# Altium schematic sheet DIGITAL_IO.SchDoc: Digital IO
size B; Engineer: M. Jones; Organization: Michael Jones; DocumentNumber: 4; Revision: RA.1; SheetNumber: 4; SheetTotal: 7
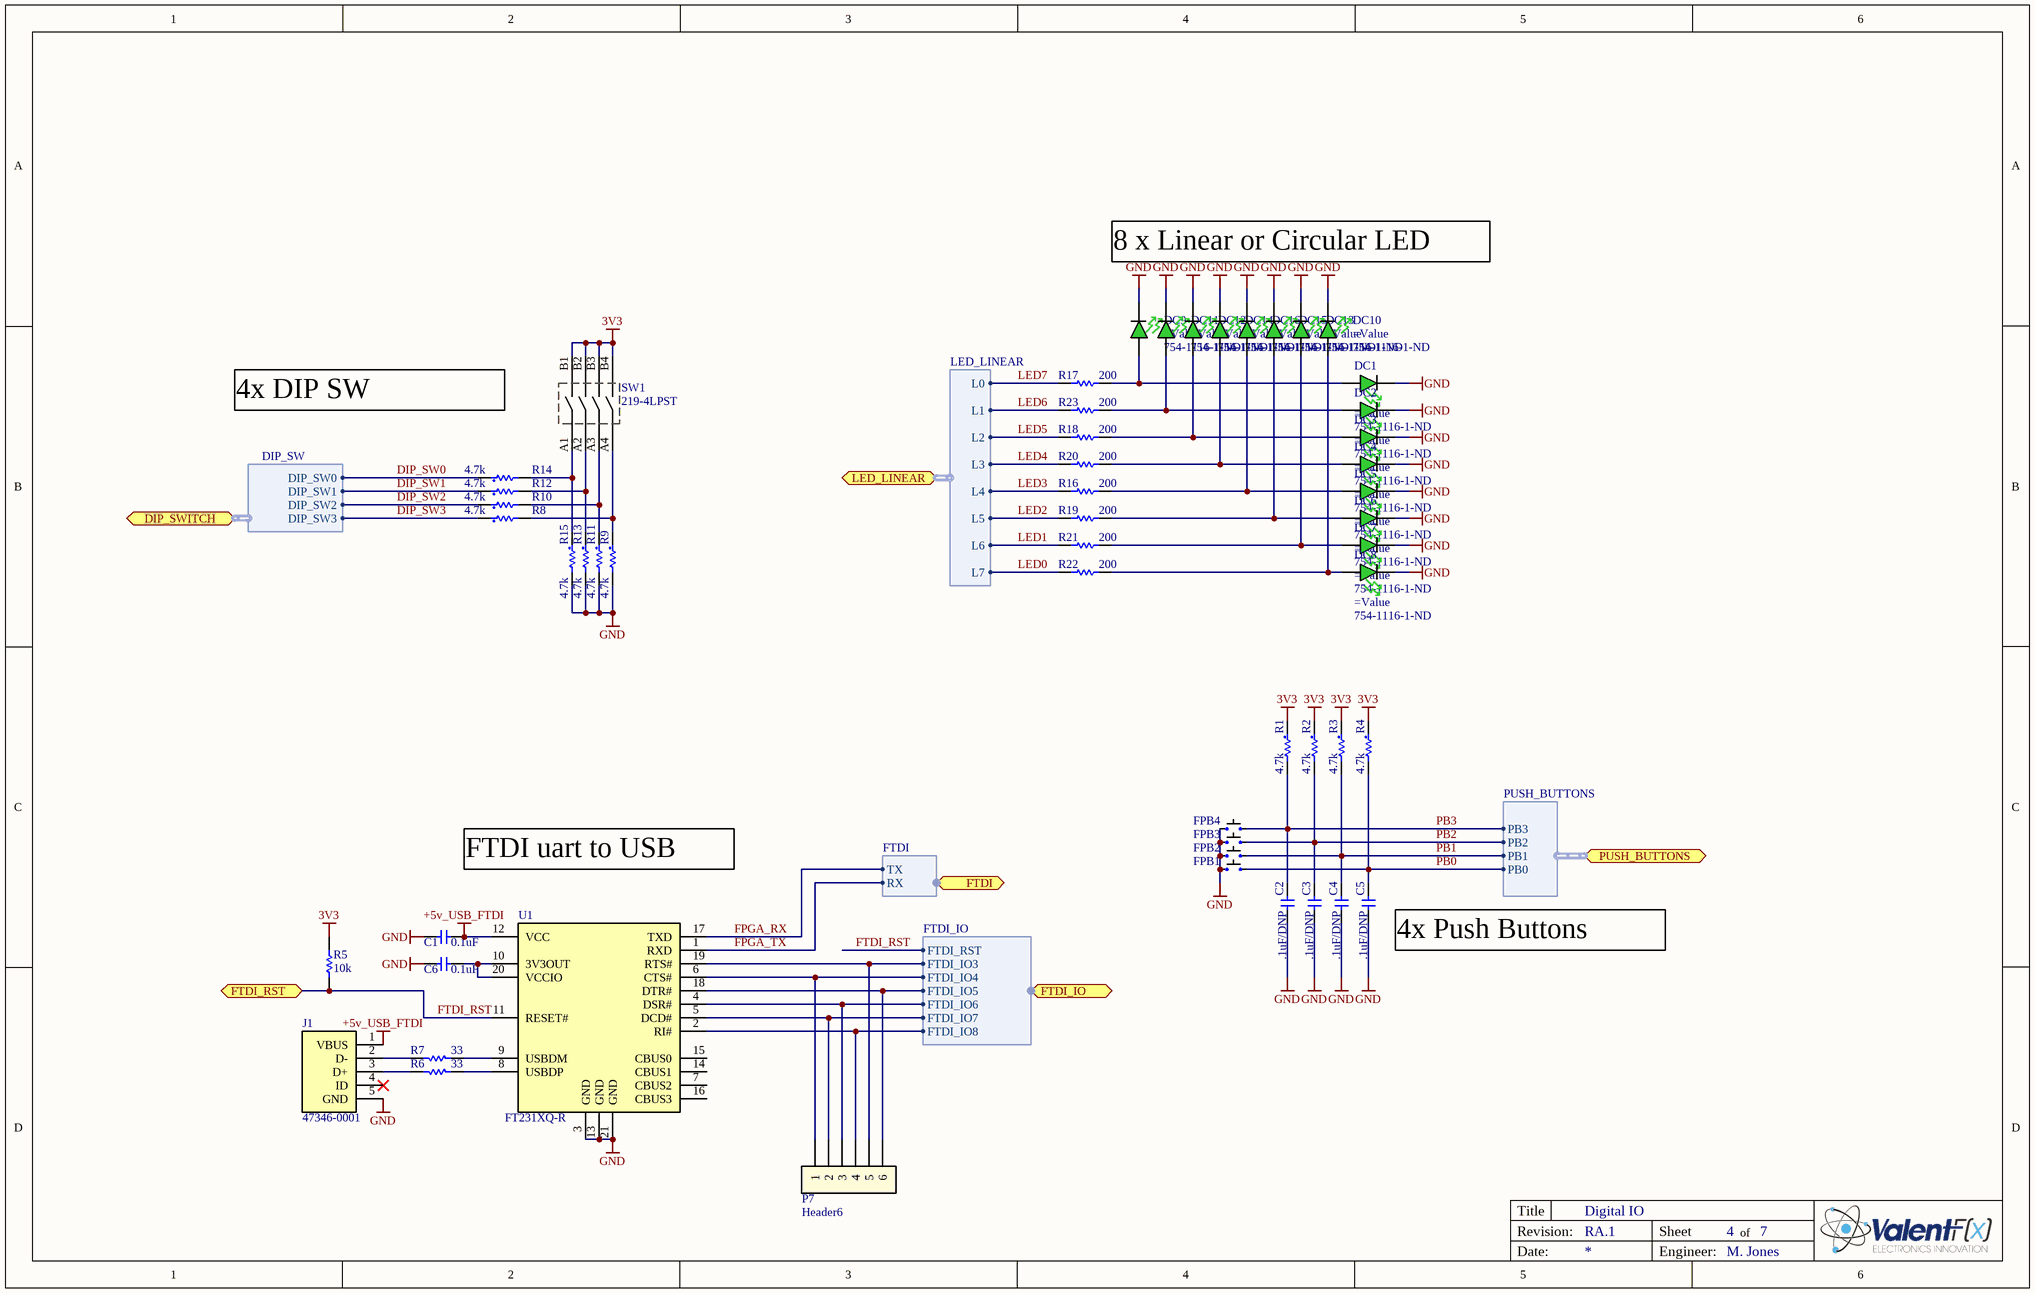
[diagram p0: DIGITAL_IO.SchDoc]

## Parts
C1  0.1uF  [C0603]
C2  .1uF/DNP  [C0603]
C3  .1uF/DNP  [C0603]
C4  .1uF/DNP  [C0603]
C5  .1uF/DNP  [C0603]
C6  0.1uF  [C0603]
DC1  Supplier Part Number 1: 754-1116-1-ND  [LED_0603 - GREEN]
DC2  Supplier Part Number 1: 754-1116-1-ND  [LED_0603 - GREEN]
DC3  Supplier Part Number 1: 754-1116-1-ND  [LED_0603 - GREEN]
DC4  Supplier Part Number 1: 754-1116-1-ND  [LED_0603 - GREEN]
DC5  Supplier Part Number 1: 754-1116-1-ND  [LED_0603 - GREEN]
DC6  Supplier Part Number 1: 754-1116-1-ND  [LED_0603 - GREEN]
DC7  Supplier Part Number 1: 754-1116-1-ND  [LED_0603 - GREEN]
DC8  Supplier Part Number 1: 754-1116-1-ND  [LED_0603 - GREEN]
DC9  Supplier Part Number 1: 754-1116-1-ND  [LED_0603 - GREEN]
DC10  Supplier Part Number 1: 754-1116-1-ND  [LED_0603 - GREEN]
DC11  Supplier Part Number 1: 754-1116-1-ND  [LED_0603 - GREEN]
DC12  Supplier Part Number 1: 754-1116-1-ND  [LED_0603 - GREEN]
DC13  Supplier Part Number 1: 754-1116-1-ND  [LED_0603 - GREEN]
DC14  Supplier Part Number 1: 754-1116-1-ND  [LED_0603 - GREEN]
DC15  Supplier Part Number 1: 754-1116-1-ND  [LED_0603 - GREEN]
DC16  Supplier Part Number 1: 754-1116-1-ND  [LED_0603 - GREEN]
FPB1  (no value)  [FSM4JSMA]
FPB2  (no value)  [FSM4JSMA]
FPB3  (no value)  [FSM4JSMA]
FPB4  (no value)  [FSM4JSMA]
J1  47346-0001  [USB - 47346-0001]
P7  Header6  [HEADER_6_30_100 SMT SIP]
R1  4.7k  [R0603]
R2  4.7k  [R0603]
R3  4.7k  [R0603]
R4  4.7k  [R0603]
R5  10k  [R0603]
R6  33  [R0603]
R7  33  [R0603]
R8  4.7k  [R0603]
R9  4.7k  [R0603]
R10  4.7k  [R0603]
R11  4.7k  [R0603]
R12  4.7k  [R0603]
R13  4.7k  [R0603]
R14  4.7k  [R0603]
R15  4.7k  [R0603]
R16  200  [R0603]
R17  200  [R0603]
R18  200  [R0603]
R19  200  [R0603]
R20  200  [R0603]
R21  200  [R0603]
R22  200  [R0603]
R23  200  [R0603]
SW1  219-4LPST  [ADE04S04]
U1  FT231XQ-R  [QFN-20_L]

## Ports
DIP_SWITCH (harness DIP_SW), FTDI (harness FTDI), FTDI_IO (harness FTDI_IO), FTDI_RST, LED_LINEAR (harness LED_LINEAR), PUSH_BUTTONS (harness PUSH_BUTTONS)

## Harnesses
PUSH_BUTTONS: PB0, PB1, PB2, PB3
LED_LINEAR: L0, L1, L2, L3, L4, L5, L6, L7
FTDI: TX, RX
FTDI_IO: FTDI_IO3, FTDI_IO4, FTDI_IO5, FTDI_IO6, FTDI_IO7, FTDI_IO8, FTDI_RST
DIP_SW: DIP_SW0, DIP_SW1, DIP_SW2, DIP_SW3

## Nets
3V3: R1.1 R2.1 R3.1 R4.1 R5.1 SW1.B1 SW1.B2 SW1.B3 SW1.B4
+5v_USB_FTDI: C1.2 J1.1(VBUS) U1.12(VCC)
GND: C1.1 C2.2 C3.2 C4.2 C5.2 C6.1 DC1.C DC2.C DC3.C DC4.C DC5.C DC6.C DC7.C DC8.C DC9.C DC10.C DC11.C DC12.C DC13.C DC14.C DC15.C DC16.C FPB1.A FPB2.A FPB3.A FPB4.A J1.5(GND) R9.2 R11.2 R13.2 R15.2 U1.3(GND) U1.13(GND) U1.21(GND)
DIP_SW0: R14.1 ; port DIP_SWITCH.DIP_SW0
DIP_SW1: R12.1 ; port DIP_SWITCH.DIP_SW1
DIP_SW2: R10.1 ; port DIP_SWITCH.DIP_SW2
DIP_SW3: R8.1 ; port DIP_SWITCH.DIP_SW3
FPGA_RX: U1.17(TXD) ; port FTDI.TX
FPGA_TX: U1.1(RXD) ; port FTDI.RX
FTDI_RST: R5.2 U1.11(RESET#) ; port FTDI_RST, port FTDI_IO.FTDI_RST
LED0: R22.2 ; port LED_LINEAR.L7
LED1: R21.2 ; port LED_LINEAR.L6
LED2: R19.2 ; port LED_LINEAR.L5
LED3: R16.2 ; port LED_LINEAR.L4
LED4: R20.2 ; port LED_LINEAR.L3
LED5: R18.2 ; port LED_LINEAR.L2
LED6: R23.2 ; port LED_LINEAR.L1
LED7: R17.2 ; port LED_LINEAR.L0
PB0: C5.1 FPB1.B R4.2 ; port PUSH_BUTTONS.PB0
PB1: C4.1 FPB2.B R3.2 ; port PUSH_BUTTONS.PB1
PB2: C3.1 FPB3.B R2.2 ; port PUSH_BUTTONS.PB2
PB3: C2.1 FPB4.B R1.2 ; port PUSH_BUTTONS.PB3
NetC6_2: C6.2 U1.10(3V3OUT) U1.20(VCCIO)
NetDC1_A: DC1.A DC9.A R17.1
NetDC2_A: DC2.A DC11.A R23.1
NetDC3_A: DC3.A DC12.A R18.1
NetDC4_A: DC4.A DC14.A R20.1
NetDC5_A: DC5.A DC16.A R16.1
NetDC6_A: DC6.A DC15.A R19.1
NetDC7_A: DC7.A DC13.A R21.1
NetDC8_A: DC8.A DC10.A R22.1
NetJ1_2: J1.2(D-) R7.2
NetJ1_3: J1.3(D+) R6.2
NetP7_1: P7.1 U1.6(CTS#) ; port FTDI_IO.FTDI_IO4
NetP7_2: P7.2 U1.5(DCD#) ; port FTDI_IO.FTDI_IO7
NetP7_3: P7.3 U1.4(DSR#) ; port FTDI_IO.FTDI_IO6
NetP7_4: P7.4 U1.2(RI#) ; port FTDI_IO.FTDI_IO8
NetP7_5: P7.5 U1.19(RTS#) ; port FTDI_IO.FTDI_IO3
NetP7_6: P7.6 U1.18(DTR#) ; port FTDI_IO.FTDI_IO5
NetR6_1: R6.1 U1.8(USBDP)
NetR7_1: R7.1 U1.9(USBDM)
NetR8_2: R8.2 R9.1 SW1.A4
NetR10_2: R10.2 R11.1 SW1.A3
NetR12_2: R12.2 R13.1 SW1.A2
NetR14_2: R14.2 R15.1 SW1.A1

Not connected (* = marked no-connect by the designer): J1 4(ID)*; U1 7(CBUS2) 14(CBUS1) 15(CBUS0) 16(CBUS3)

## Notes on the sheet
- 8 x Linear or Circular LED
- 4x DIP SW
- FTDI uart to USB
- (near C5) 4x Push Buttons
- Title
- Revision:
- Sheet
- of
- Date:
- Engineer:

## Library data of the parts
C1 C6 = GRM188R71H104KA93D: CAP CER .1UF 50V 10% X7R 0603; Manufacturer: Murata Electronics North America; Capacitance: 0.1µF; Value: 0.1uF; Supplier 1: Digi-Key; Supplier Part Number 1: 490-1519-1-ND; Manufacturer Part Number: GRM188R71H104KA93D; RoHS: RoHS Compliant; Category: Capacitors; Stock 1: 6315460; Pricing 1: 10=0.037, 100=0.0221, 500=0.01276, 1000=0.00884 (USD); Voltage - Rated: 50V; Tolerance: ±10%; Temperature Coefficient: X7R; Mounting Type: Surface Mount, MLCC; Operating Temperature: -55°C ~ 125°C; Features: -; Applications: General Purpose; Ratings: -; Package / Case: 0603 (1608 Metric); Size / Dimension: 0.063" L x 0.031" W (1.60mm x 0.80mm); Lead Spacing: -; Thickness: 0.80mm; Packaging: Cut Tape (CT); Lead Style: -; ComponentLink1URL: http://search.murata.co.jp/Ceramy/image/img/PDF/ENG/GRM188R71H104KA93.pdf; ComponentLink1Description: http://search.murata.co.jp/Ceramy/image/img/PDF/ENG/GRM188R71H104KA93.pdf
C2-C5 = GRM188R71H104KA93D: CAP CER .1UF 50V 10% X7R 0603; Manufacturer: Murata Electronics North America; Value: 0.1uF; Capacitance: 0.1µF; Supplier 1: Digi-Key; Supplier Part Number 1: 490-1519-1-ND; Manufacturer Part Number: GRM188R71H104KA93D; RoHS: RoHS Compliant; Category: Capacitors; Stock 1: 6315460; Pricing 1: 10=0.037, 100=0.0221, 500=0.01276, 1000=0.00884 (USD); Voltage - Rated: 50V; Tolerance: ±10%; Temperature Coefficient: X7R; Mounting Type: Surface Mount, MLCC; Operating Temperature: -55°C ~ 125°C; Features: -; Applications: General Purpose; Ratings: -; Package / Case: 0603 (1608 Metric); Size / Dimension: 0.063" L x 0.031" W (1.60mm x 0.80mm); Lead Spacing: -; Thickness: 0.80mm; Packaging: Cut Tape (CT); Lead Style: -; ComponentLink1URL: http://search.murata.co.jp/Ceramy/image/img/PDF/ENG/GRM188R71H104KA93.pdf; ComponentLink1Description: http://search.murata.co.jp/Ceramy/image/img/PDF/ENG/GRM188R71H104KA93.pdf
DC1-DC16 = APT1608CGCK: LED 1.6X0.8MM 570NM GRN CLR SMD; Manufacturer: Kingbright Corp; Current - Test: 20mA; Wavelength - Peak: 574nm; Millicandela Rating: 50mcd; Voltage - Forward (Vf) Typ: 2.1V; Lens Type: Clear; Lens Style/Size: Rectangle with Flat Top, 1.2mm x 0.8mm; Viewing Angle: 120°; Supplier 1: Digi-Key; Manufacturer Part Number: APT1608CGCK; RoHS: RoHS Compliant; Category: Optoelectronics; Stock 1: 98122; Pricing 1: 1=0.2, 10=0.153, 25=0.1224, 100=0.1105, 250=0.102, 500=0.0918 (USD); Color: Green; Luminous Flux @ Current - Test: -; Wavelength - Dominant: 570nm; Size / Dimension: 1.60mm L x 0.80mm W; Height: 0.75mm; Package / Case: 0603 (1608 Metric); Mounting Type: Surface Mount; Packaging: Cut Tape (CT); ComponentLink1URL: http://www.us.kingbright.com/images/catalog/SPEC/APT1608CGCK.pdf; ComponentLink1Description: http://www.us.kingbright.com/images/catalog/SPEC/APT1608CGCK.pdf
FPB1-FPB4 = FSM4JSMATR: SWITCH TACTILE SPST-NO 0.05A 12V; Manufacturer: TE Connectivity; Switch Function: Off-Mom; Contact Rating @ Voltage: 0.05A @ 12VDC; Actuator Type: Standard; Outline: 6.00mm x 6.00mm; Illumination: Non-Illuminated; Operating Force: 160gf; Actuator Height off PCB, from Pins: 5.00mm; Actuator Orientation: Top Actuated; Actuator Material: Polyphenylene Sulfide (PPS); Switch Travel: 0.25mm; Mechanical Life: 100,000 Cycles; Supplier 1: Digi-Key; Supplier Part Number 1: 450-1129-ND; Manufacturer Part Number: FSM4JSMA; RoHS: RoHS Compliant; Category: Switches; Stock 1: 13038; Pricing 1: 1=0.26, 10=0.246, 25=0.2096, 50=0.1834, 100=0.1703, 250=0.15064, 500=0.1441, 1000=0.1179, 5000=0.09825 (USD); Circuit: SPST-NO; Mounting Type: Surface Mount; Termination Style: Gull Wing; Packaging: Bulk; ComponentLink1URL: http://www.te.com/commerce/DocumentDelivery/DDEController?Action=srchrtrv&DocNm=2-1437565-7&DocType=Customer+Drawing&DocLang=English; ComponentLink1Description: http://www.te.com/commerce/DocumentDelivery/DDEController?Action=srchrtrv&DocNm=2-1437565-7&DocType=Customer+Drawing&DocLang=English; Illumination Voltage (Nominal): -; Illumination Type, Color: -; Ingress Protection: -; Features: -; Operating Temperature: -35°C ~ 85°C
J1 = USB - 0473460001: Micro B CONN RCPT 5POS MICRO B USB R/A; Manufacturer: Molex Inc; Description: CONN RCPT 5POS MICRO USB R/A; Connector Type: USB - micro B; Number of Contacts: 5; Gender: Receptacle; Supplier 1: Digi-Key; Manufacturer Part Number: 0473460001; RoHS: RoHS Compliant; Category: Connectors, Interconnects; Stock 1: 2501; Pricing 1: 1=1, 10=0.877, 25=0.8252, 50=0.7906, 100=0.7563, 250=0.68752, 500=0.61876, 1000=0.55 (USD); Specifications: -; Mounting Type: Surface Mount, Right Angle, Horizontal; Features: Shielded; Packaging: Cut Tape (CT); Ingress Protection: -; ComponentLink1URL: http://www.molex.com/pdm_docs/sd/473460001_sd.pdf; ComponentLink1Description: http://www.molex.com/pdm_docs/sd/473460001_sd.pdf; Supplier Part Number 1: WM17141CT-ND; Value: 47346-0001
P7 = Header6: Header 6 pin
R1-R4 R8-R15 = R0603 - CRCW06034K70FKEA: 4.7k Thick Film Resistors - SMD 1/10watt 4.7Kohms 1%; Manufacturer: Vishay Dale; Description: RES 4.70K OHM 1/10W 1% 0603 SMD; Power (Watts): 0.1W, 1/10W; Temperature Coefficient: ±100ppm/°C; Supplier 1: Digi-Key; Manufacturer Part Number: CRCW06034K70FKEA; RoHS: RoHS Compliant; Category: Resistors; Stock 1: 51919; Pricing 1: 10=0.081, 50=0.0436, 200=0.0251, 1000=0.01711 (USD); Resistance (Ohms): 4.7K; Composition: Thick Film; Features: -; Tolerance: ±1%; Package / Case: 0603 (1608 Metric); Size / Dimension: 0.061" L x 0.033" W (1.55mm x 0.85mm); Height: 0.020" (0.50mm); Number of Terminations: 2; Packaging: Cut Tape (CT); ComponentLink1URL: http://www.vishay.com/doc?20035; ComponentLink1Description: http://www.vishay.com/doc?20035; Supplier Part Number 1: 541-4.70KHCT-ND; Value: 4.7k
R5 = ERJ-3EKF1002V: RES 10.0K OHM 1/10W 1% 0603 SMD; Source Part Number: P10.0KHCT-ND; Manufacturer: Panasonic - ECG; Power (Watts): 0.1W, 1/10W; Temperature Coefficient: ±100ppm/°C; Source: Digikey; ROHS Certificate: *; RoHS: RoHS Compliant; Category: Resistors; Resistance In Ohms: 10.0K; Composition: Thick Film; Features: -; Tolerance: ±1%; Case: 0603 (1608 metric); Size / Dimension: 0.063" L x 0.031" W (1.60mm x 0.80mm); Height: 0.018" (0.45mm); Lead Style: Surface Mount (SMD - SMT); Packaging: Cut Tape (CT); ComponentLink1URL: http://industrial.panasonic.com/www-cgi/jvcr13pz.cgi?E+PZ+3+AOA0002+ERJ3EKF1002V+7+WW; ComponentLink1Description: http://industrial.panasonic.com/www-cgi/jvcr13pz.cgi?E+PZ+3+AOA0002+ERJ3EKF1002V+7+WW; Manufacturer Part Number: ERJ-3EKF1002V; Supplier 1: Digi-Key; Stock 1: 10570746; Pricing 1: 1=0.04, 50=0.015, 100=0.0114, 250=0.00844, 500=0.00624, 1000=0.00416 (USD); Supplier Part Number 1: P10.0KHCT-ND; Value: 10k
R6 R7 = ERJ-3EKF33R0V: RES 33.0 OHM 1/10W 1% 0603 SMD; Manufacturer: Panasonic - ECG; Power (Watts): 0.1W, 1/10W; Temperature Coefficient: ±100ppm/°C; Value: 33; Supplier 1: Digi-Key; Manufacturer Part Number: ERJ-3EKF33R0V; RoHS: RoHS Compliant; Category: Resistors; Stock 1: 1263163; Pricing 1: 1=0.04, 50=0.0138, 100=0.0105, 250=0.0078, 500=0.00576, 1000=0.00384 (USD); Resistance (Ohms): 33; Composition: Thick Film; Features: -; Tolerance: ±1%; Size / Dimension: 0.063" L x 0.031" W (1.60mm x 0.80mm); Height: 0.018" (0.45mm); Number of Terminations: 2; Packaging: Cut Tape (CT); Package / Case: 0603 (1608 Metric); ComponentLink1URL: http://industrial.panasonic.com/www-cgi/jvcr13pz.cgi?E+PZ+3+AOA0002+ERJ3EKF33R0V+7+WW; ComponentLink1Description: http://industrial.panasonic.com/www-cgi/jvcr13pz.cgi?E+PZ+3+AOA0002+ERJ3EKF33R0V+7+WW; Supplier Part Number 1: P33.0HCT-ND
R16-R23 = ERJ-3EKF2000V: RES 200 OHM 1/10W 1% 0603 SMD; Manufacturer: Panasonic - ECG; Power (Watts): 0.1W, 1/10W; Temperature Coefficient: ±100ppm/°C; Manufacturer Part Number: ERJ-3EKF2000V; Value: RES 200 OHM 1/10W 1% 0603 SMD; Supplier 1: Digi-Key; Supplier Part Number 1: P200HCT-ND; RoHS: RoHS Compliant; Category: Resistors; Stock 1: 1279595; Pricing 1: 1=0.04, 50=0.015, 100=0.0114, 250=0.00844, 500=0.00624, 1000=0.00416 (USD); Resistance (Ohms): 200; Composition: Thick Film; Features: -; Tolerance: ±1%; Size / Dimension: 0.063" L x 0.031" W (1.60mm x 0.80mm); Height: 0.018" (0.45mm); Lead Style: Surface Mount (SMD - SMT); Packaging: Cut Tape (CT); Package / Case: 0603 (1608 Metric); ComponentLink1URL: http://industrial.panasonic.com/www-cgi/jvcr13pz.cgi?E+PZ+3+AOA0002+ERJ3EKF2000V+7+WW; ComponentLink1Description: http://industrial.panasonic.com/www-cgi/jvcr13pz.cgi?E+PZ+3+AOA0002+ERJ3EKF2000V+7+WW
SW1 = DIP SW - 219-4LPST: SWITCH TAPE SEAL 4 POS SMD; Manufacturer: CTS Electrocomponents; Circuit: SPST; Number of Positions: 4; Contact Rating @ Voltage: 0.1A @ 50VDC; Actuator Type: Standard; Actuator Level: Flush; Washable: Yes; Supplier 1: Digi-Key; Manufacturer Part Number: 219-4LPST; RoHS: RoHS Compliant; Category: Switches; Stock 1: 0; Pricing 1: 1=0.76, 10=0.744, 100=0.6296, 500=0.54378, 1000=0.50085, 5000=0.40784 (USD); Mounting Type: Surface Mount; Orientation: Top Actuated; ComponentLink1URL: http://www.ctscorp.com/components/Datasheets/219.pdf; ComponentLink1Description: http://www.ctscorp.com/components/Datasheets/219.pdf; Supplier Part Number 1: CT2194LPST-ND; Value: 219-4LPST
U1 = USB - FT231XQ-R: IC USB SERIAL FULL UART QFN-20 ftdi; Manufacturer: FTDI, Future Technology Devices International Ltd; FIFO's: 512 Byte; Number of Channels: 1, UART; Protocol: RS232, RS422, RS485; Voltage - Supply: 3.3 V ~ 5 V; With Auto Flow Control: Yes; Description: IC USB SERIAL FULL UART QFN-20; Category: Integrated Circuits (ICs); Features: USB to UART with Battery Detection; ComponentLink1URL: http://www.ftdichip.com/Support/Documents/DataSheets/ICs/DS_FT231X.pdf; ComponentLink1Description: http://www.ftdichip.com/Support/Documents/DataSheets/ICs/DS_FT231X.pdf; Supplier 1: Digi-Key; Manufacturer Part Number: FT231XQ-R; RoHS: RoHS Compliant; Stock 1: 0; Pricing 1: 1=2.38, 10=2.142, 25=2.0232, 50=1.904, 100=1.785, 250=1.666, 500=1.6065, 1000=1.5827 (USD); With Parallel Port: -; With IrDA Encoder/Decoder: -; With False Start Bit Detection: -; With Modem Control: Yes; With CMOS: Yes; Mounting Type: Surface Mount; Package / Case: 20-WFQFN Exposed Pad; Supplier Device Package: 20-QFN Exposed Pad (4x4); Packaging: Cut Tape (CT); Supplier Part Number 1: 768-1128-1-ND; Value: FT231XQ-R